# Altium schematic sheet jackBus.SchDoc
size A4
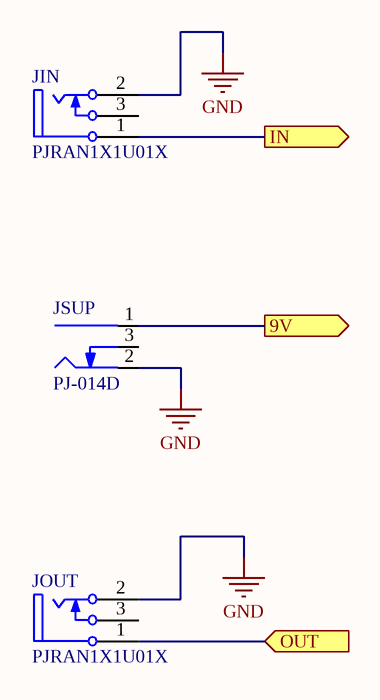
[diagram p0: jackBus.SchDoc]

## Parts
JIN  PJRAN1X1U01X  [SWIT-PJRAN1X1U01X_V]
JOUT  PJRAN1X1U01X  [SWIT-PJRAN1X1U01X_V]
JSUP  PJ-014D  [CUI PJ-014D]

## Ports
9V (out), IN (out), OUT (in)

## Nets
GND: JIN.2(TIP) JOUT.2(TIP) JSUP.2(Outer)
9V: JSUP.1(Centre) ; port 9V
IN: JIN.1(SLEEVE) ; port IN
OUT: JOUT.1(SLEEVE) ; port OUT

Not connected (* = marked no-connect by the designer): JIN 3(SHUNT); JOUT 3(SHUNT); JSUP 3(SW)

## Library data of the parts
JIN JOUT = CMP-1772-00003-1: Female Phono Jack, 3 Position, Height 13 mm, Tail Length 4 mm, RoHS, Bulk; Case\Package: Radial; Type (Capacitors): X7R; Tolerance: 10%; Voltage Rating (DC): 50 V; Capacitance: 100 nF; Package Quantity: 500; Mount: Through Hole; Packaging: Bulk; Height: 3.18 mm; Min Operating Temperature: -55 degC; Radiation Hardening: No; PackageDescription: Female Phono Jack, 3 Position, Height 13 mm, Tail Length 4 mm; Length: 6.6 mm; Lead Pitch: 2.54 mm; Width: 5.08 mm; REACH SVHC: No SVHC; ComponentLink1Description: Manufacturer URL; Max Operating Temperature: 125 degC; ComponentLink2Description: Datasheet; DatasheetVersion: Rev. A, 01/2006; Voltage Rating: 50 V; ComponentLink2URL: http://www.conxall.com/Drawings/pjran1x1u__x_series_cd.pdf; ComponentLink1URL: http://www.switchcraft.com/; RoHSCompliant: true; Pins: 2; PackageReference: PJRAN1X1U01X
JSUP = PJ-014D: CONN PWR JACK 1.3X3.4MM SOLDER; Manufacturer: CUI Devices; Actual Diameter: 0.051" (1.30mm ID), 0.165" (4.20mm OD); Current Rating (Amps): 2.5A; Gender: Male; Industry Recognized Mating Diameter: 1.30mm ID (0.051"), 3.40mm OD (0.134"); Internal Switch(s): Single Switch, Normally Closed; Material Flammability Rating: UL94 V-0; Mating Length/Depth: 0.283" (7.20mm); Number of Positions/Contacts: 2 Conductors, 3 Contacts; Shielding: Unshielded; Voltage - Rated: 24VDC; Part Number: PJ-014D; ComponentLink1Description: Datasheet; ComponentLink1URL: https://www.cuidevices.com/product/resource/digikeypdf/pj-014d.pdf; ComponentLink2Description: DigiKey Link; ComponentLink2URL: //digikey.com/product-detail/en/cui-devices/PJ-014D/CP-014D-ND/372124; Connector Type: Jack; Features: Board Guide; LastUpdated: 16/12/2019 18:55:00; Lifecycle Status: 0; Minimum Order: 1; Mounting Type: Through Hole, Right Angle; Packaging: Bulk; Part Status: Active; Price: 0.65; Series: -; Supplier 1: DigiKey; Supplier Part Number 1: CP-014D-ND; Termination: Solder